# Altium schematic sheet PFIL.SchDoc
size B; DrawnBy: PWS; Engineer: PWS; Address1: 222 W. Washington Ave.; DocumentNumber: 5; Revision: 1; SheetNumber: 5; SheetTotal: 7
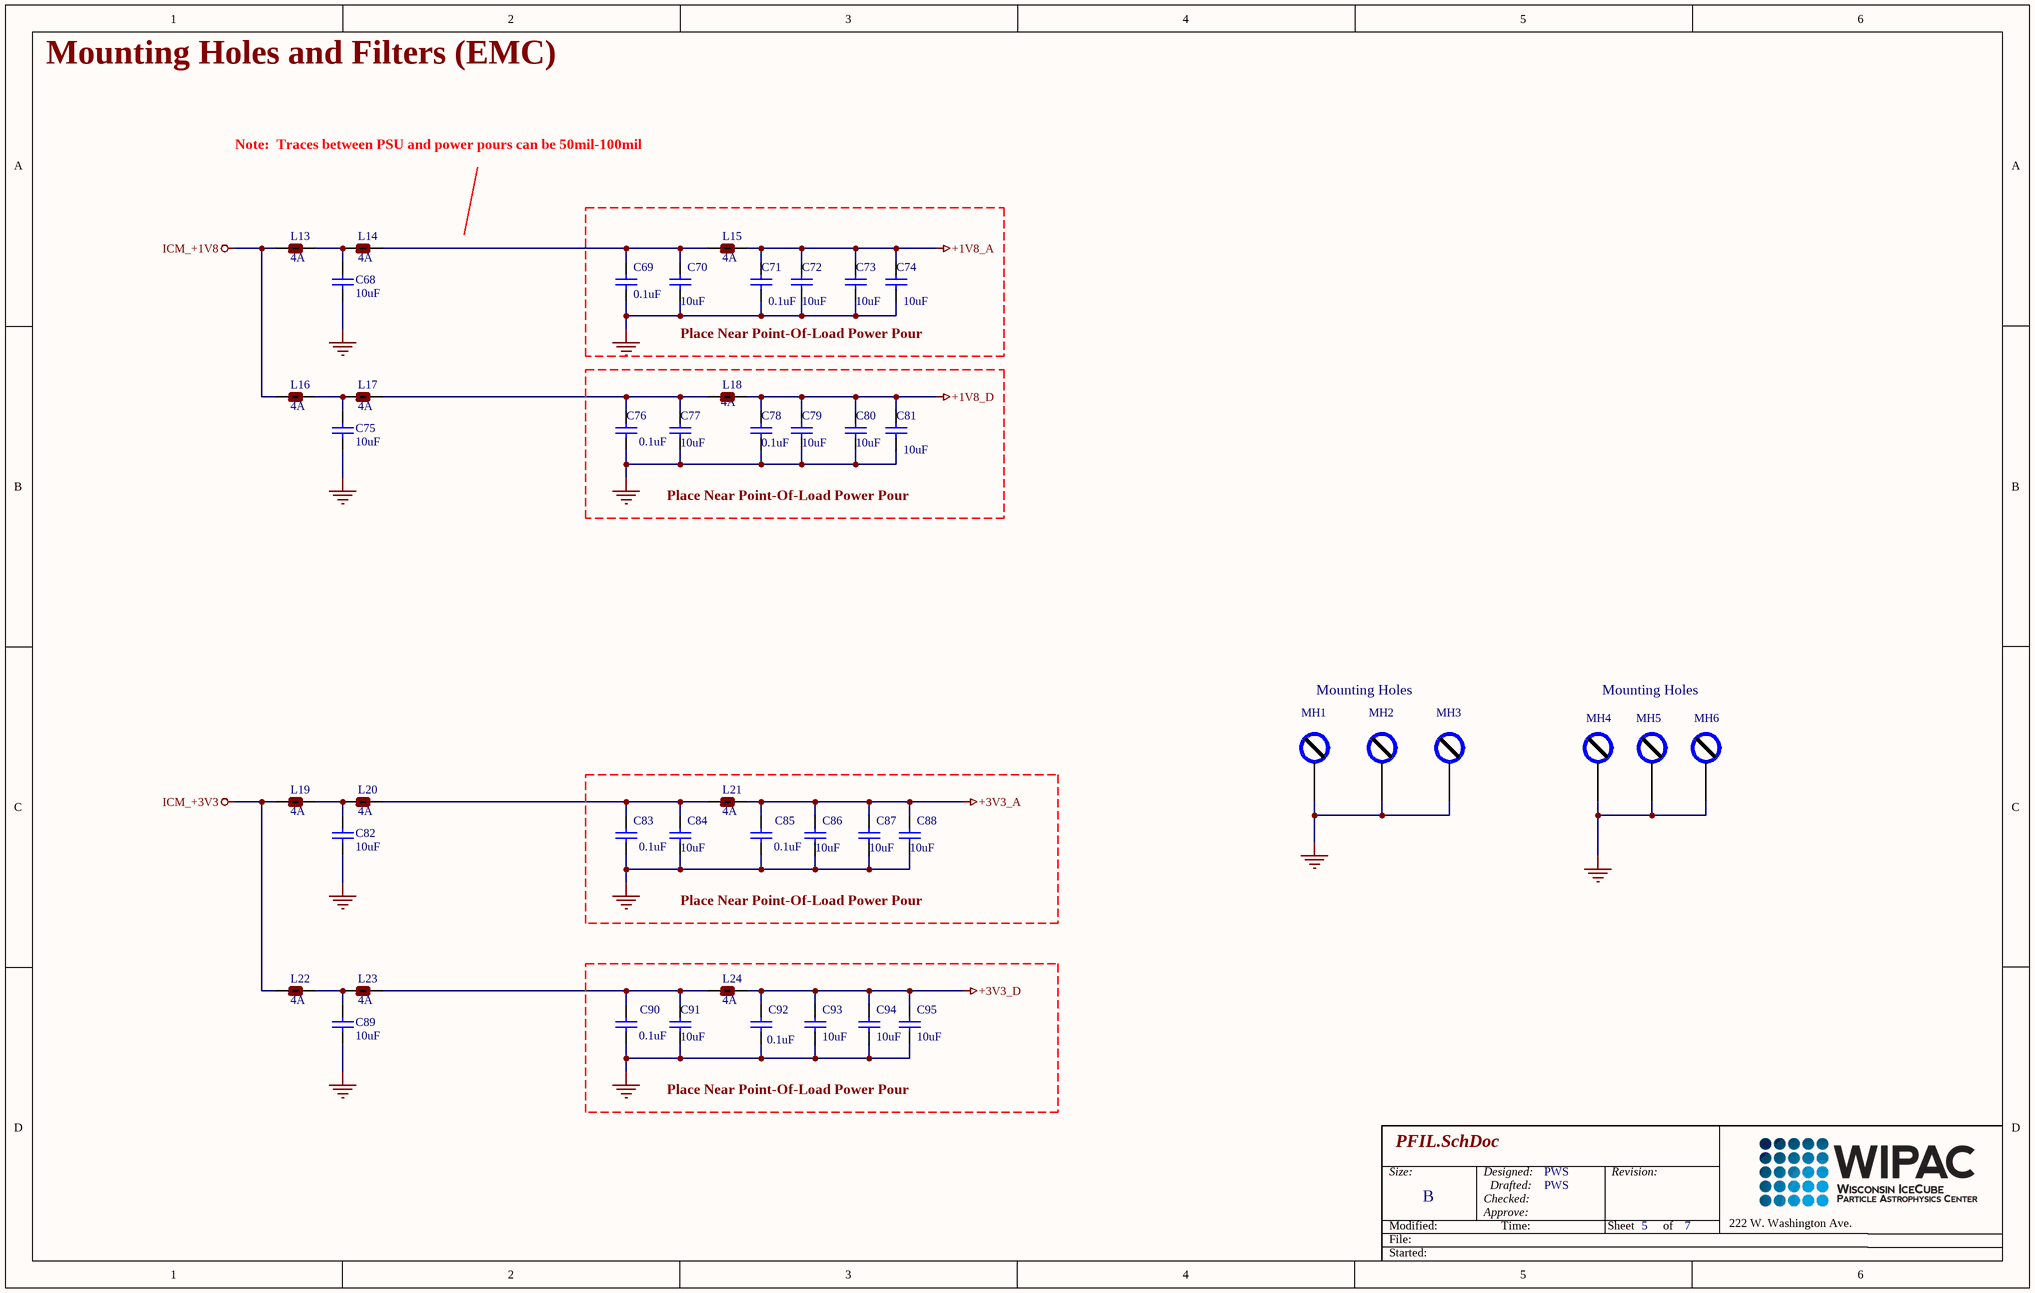
[diagram p0: PFIL.SchDoc]

## Parts
C68  Capacitance: 10uF  [CAPC_0805]  (hidden comment: 10uF_805_10V)
C69  Capacitance: 0.1uF  [CAPC_0603]  (hidden comment: 0.1uF_603_50V)
C70  Capacitance: 10uF  [CAPC_0805]  (hidden comment: 10uF_805_10V)
C71  Capacitance: 0.1uF  [CAPC_0603]  (hidden comment: 0.1uF_603_50V)
C72  Capacitance: 10uF  [CAPC_0805]  (hidden comment: 10uF_805_10V)
C73  Capacitance: 10uF  [CAPC_0805]  (hidden comment: 10uF_805_10V)
C74  Capacitance: 10uF  [CAPC_0805]  (hidden comment: 10uF_805_10V)
C75  Capacitance: 10uF  [CAPC_0805]  (hidden comment: 10uF_805_10V)
C76  Capacitance: 0.1uF  [CAPC_0603]  (hidden comment: 0.1uF_603_50V)
C77  Capacitance: 10uF  [CAPC_0805]  (hidden comment: 10uF_805_10V)
C78  Capacitance: 0.1uF  [CAPC_0603]  (hidden comment: 0.1uF_603_50V)
C79  Capacitance: 10uF  [CAPC_0805]  (hidden comment: 10uF_805_10V)
C80  Capacitance: 10uF  [CAPC_0805]  (hidden comment: 10uF_805_10V)
C81  Capacitance: 10uF  [CAPC_0805]  (hidden comment: 10uF_805_10V)
C82  Capacitance: 10uF  [CAPC_0805]  (hidden comment: 10uF_805_10V)
C83  Capacitance: 0.1uF  [CAPC_0603]  (hidden comment: 0.1uF_603_50V)
C84  Capacitance: 10uF  [CAPC_0805]  (hidden comment: 10uF_805_10V)
C85  Capacitance: 0.1uF  [CAPC_0603]  (hidden comment: 0.1uF_603_50V)
C86  Capacitance: 10uF  [CAPC_0805]  (hidden comment: 10uF_805_10V)
C87  Capacitance: 10uF  [CAPC_0805]  (hidden comment: 10uF_805_10V)
C88  Capacitance: 10uF  [CAPC_0805]  (hidden comment: 10uF_805_10V)
C89  Capacitance: 10uF  [CAPC_0805]  (hidden comment: 10uF_805_10V)
C90  Capacitance: 0.1uF  [CAPC_0603]  (hidden comment: 0.1uF_603_50V)
C91  Capacitance: 10uF  [CAPC_0805]  (hidden comment: 10uF_805_10V)
C92  Capacitance: 0.1uF  [CAPC_0603]  (hidden comment: 0.1uF_603_50V)
C93  Capacitance: 10uF  [CAPC_0805]  (hidden comment: 10uF_805_10V)
C94  Capacitance: 10uF  [CAPC_0805]  (hidden comment: 10uF_805_10V)
C95  Capacitance: 10uF  [CAPC_0805]  (hidden comment: 10uF_805_10V)
L13  Max DC Current: 4A  [SMD-0805]  (hidden comment: 4.0A_Bead_0805)
L14  Max DC Current: 4A  [SMD-0805]  (hidden comment: 4.0A_Bead_0805)
L15  Max DC Current: 4A  [SMD-0805]  (hidden comment: 4.0A_Bead_0805)
L16  Max DC Current: 4A  [SMD-0805]  (hidden comment: 4.0A_Bead_0805)
L17  Max DC Current: 4A  [SMD-0805]  (hidden comment: 4.0A_Bead_0805)
L18  Max DC Current: 4A  [SMD-0805]  (hidden comment: 4.0A_Bead_0805)
L19  Max DC Current: 4A  [SMD-0805]  (hidden comment: 4.0A_Bead_0805)
L20  Max DC Current: 4A  [SMD-0805]  (hidden comment: 4.0A_Bead_0805)
L21  Max DC Current: 4A  [SMD-0805]  (hidden comment: 4.0A_Bead_0805)
L22  Max DC Current: 4A  [SMD-0805]  (hidden comment: 4.0A_Bead_0805)
L23  Max DC Current: 4A  [SMD-0805]  (hidden comment: 4.0A_Bead_0805)
L24  Max DC Current: 4A  [SMD-0805]  (hidden comment: 4.0A_Bead_0805)
MH1  Mounting Hole  [Mounting Pad #4 - Standoff]  (value not drawn)  (no BOM)
MH2  Mounting Hole  [Mounting Pad #4 - Standoff]  (value not drawn)  (no BOM)
MH3  Mounting Hole  [Mounting Pad #4 - Standoff]  (value not drawn)  (no BOM)
MH4  Mounting Hole  [Mounting Pad #4 - Standoff]  (value not drawn)  (no BOM)
MH5  Mounting Hole  [Mounting Pad #4 - Standoff]  (value not drawn)  (no BOM)
MH6  Mounting Hole  [Mounting Pad #4 - Standoff]  (value not drawn)  (no BOM)

## Nets
+1V8_A: C71.2 C72.2 C73.2 C74.2 L15.2
+1V8_D: C78.2 C79.2 C80.2 C81.2 L18.2
+3V3_A: C85.2 C86.2 C87.2 C88.2 L21.2
+3V3_D: C92.2 C93.2 C94.2 C95.2 L24.2
GND: C68.1 C69.1 C70.1 C71.1 C72.1 C73.1 C74.1 C75.1 C76.1 C77.1 C78.1 C79.1 C80.1 C81.1 C82.1 C83.1 C84.1 C85.1 C86.1 C87.1 C88.1 C89.1 C90.1 C91.1 C92.1 C93.1 C94.1 C95.1 MH1.0 MH2.0 MH3.0 MH4.0 MH5.0 MH6.0
ICM_+1V8: L13.1 L16.1
ICM_+3V3: L19.1 L22.1
NetC68_2: C68.2 L13.2 L14.1
NetC69_2: C69.2 C70.2 L14.2 L15.1
NetC75_2: C75.2 L16.2 L17.1
NetC76_2: C76.2 C77.2 L17.2 L18.1
NetC82_2: C82.2 L19.2 L20.1
NetC83_2: C83.2 C84.2 L20.2 L21.1
NetC89_2: C89.2 L22.2 L23.1
NetC90_2: C90.2 C91.2 L23.2 L24.1

## Notes on the sheet
- Mounting Holes and Filters (EMC)
- Note:  Traces between PSU and power pours can be 50mil-100mil
- Place Near Point-Of-Load Power Pour
- Mounting Holes
- Size:
- Designed:
- Revision:
- Modified:
- File:
- B
- Checked:
- Approve:
- Drafted:
- Time:
- Sheet
- of
- Started:

## Library data of the parts
C68 C70 C72-C75 C77 C79-C82 C84 C86-C89 C91 C93-C95 = CapC_10uF_805_10V: Capacitor; Manufacturer: Murata; Manufacturer Part Number: GCJ21BR71A106KE01L; Tolerance: 10%; Voltage Rating: 10V; Dielectric: X7R; Supplier 1: Digi-Key; RoHS: Yes; Packaging: Tape and Reel; Ratings: AEC-Q200; Features: Soft Termination; ComponentLink1URL: https://www.murata.com/~/media/webrenewal/support/library/catalog/products/capacitor/mlcc/c03e.ashx?la=en-us; ComponentLink1Description: Datasheet; Supplier Part Number 1: 490-12646-1-ND; ComponentLink2Description: Supplier Link; ComponentLink2URL: https://www.digikey.com/products/en?keywords=490-12646-1-ND; Stock 1: 140399; Pricing 1: 1 = 0.70000, 10 = 0.49300, 100 = 0.32440, 500 = 0.24032, 1000 = 0.20428 (USD); Mount: Surface Mount; Case/Package: 0805; Weight: 0.000335oz; Case Code (Metric): 2012; Case Code (Imperial): 0805; Min Operating Temperature: -55°C; Max Operating Temperature: 125°C; Termination: SMD/SMT; Voltage Rating (DC): 10V; Package Quantity: 3000; Length: 2mm; Height: 1.25mm; Width: 0.049inch; Thickness: 0.057inch; Depth: 1.25mm
C69 C71 C76 C78 C83 C85 C90 C92 = CapC_0.1uF_603_50V_GCJ: 0.1µF ±10% 50V Ceramic Capacitor X7R 0603 (1608 Metric); Manufacturer: Murata; Manufacturer Part Number: GCJ188R71H104KA12D; Supplier 1: Digi-Key; Supplier Part Number 1: 490-5798-1-ND; RoHS: Yes; Packaging: Tape and Reel; Tolerance: 10%; Ratings: AEC-Q200; ComponentLink1URL: https://psearch.en.murata.com/capacitor/product/GCJ188R71H104KA12%23.pdf; ComponentLink1Description: Datasheet; ComponentLink2Description: Supplier Link; ComponentLink2URL: https://www.digikey.com/products/en?keywords=490-5798-1-ND; Stock 1: 2321609; Pricing 1: 1=0.28000, 10=0.19200, 100=0.10890, 500=0.07686, 1000=0.06725 (USD); Mount: Surface Mount; Case/Package: 0603; Case Code (Imperial): 0603; Case Code (Metric): 1608; Min Operating Temperature: -55°C; Max Operating Temperature: 125°C; Voltage Rating: 50V; Dielectric: X7R; Termination: SMD/SMT; Voltage Rating (DC): 50V; Package Quantity: 1; Length: 1.6mm; Height: 0.8mm; Width: 0.031inch; Thickness: 0.035inch; Features: Soft Termination; Depth: 0.8mm; Radiation Hardening: No; Lead Free: Lead Free
L13-L24 = Bead SM_805_4.0A_TDK: 100 Ohms @ 100MHz 1 Power Line Ferrite Bead 0805 (2012 Metric) 4A 20mOhm; Manufacturer: TDK; Manufacturer Part Number: MPZ2012S101ATD25; DC Resistance (DCR): 20mR; Number of Lines: 1; Impedance: 100R; Tolerance: 25%; Supplier 1: Digi-Key; RoHS: Yes; Stock 1: 173046; Pricing 1: 1=0.13000, 10=0.10400, 25=0.08080, 50=0.06700, 100=0.05780, 250=0.04620, 500=0.04158, 1000=0.03465 (USD); Packaging: Tape and Reel; ComponentLink1URL: https://product.tdk.com/info/en/catalog/datasheets/beads_automotive_power_mpz2012_en.pdf; ComponentLink1Description: Datasheet; Supplier Part Number 1: 445-172903-1-ND; Mount: Surface Mount; Case/Package: 0805; Weight: 0.000194oz; Case Code (Metric): 2012; Case Code (Imperial): 0805; Min Operating Temperature: -55°C; Max Operating Temperature: 125°C; Package Quantity: 4000; Termination: SMD/SMT; Test Frequency: 100MHz; Length: 0.079inch; Height: 0.85mm; Width: 1.25mm; Ratings: AEC-Q200; Lead Free: Lead Free; Max Current Rating: 4A; Core Material: Ferrite; Depth: 1.25mm; ComponentLink2Description: MPZ Series; ComponentLink2URL: https://media.digikey.com/pdf/Data%20Sheets/TDK%20PDFs/MPZ_Series_Br.pdf; ComponentLink3Description: Supplier Link; ComponentLink3URL: https://www.digikey.com/products/en?keywords=445-172903-1-ND
MH1-MH6 = Mounting Hole #4_Standoff